# Altium schematic sheet CPU.SchDoc
size A3
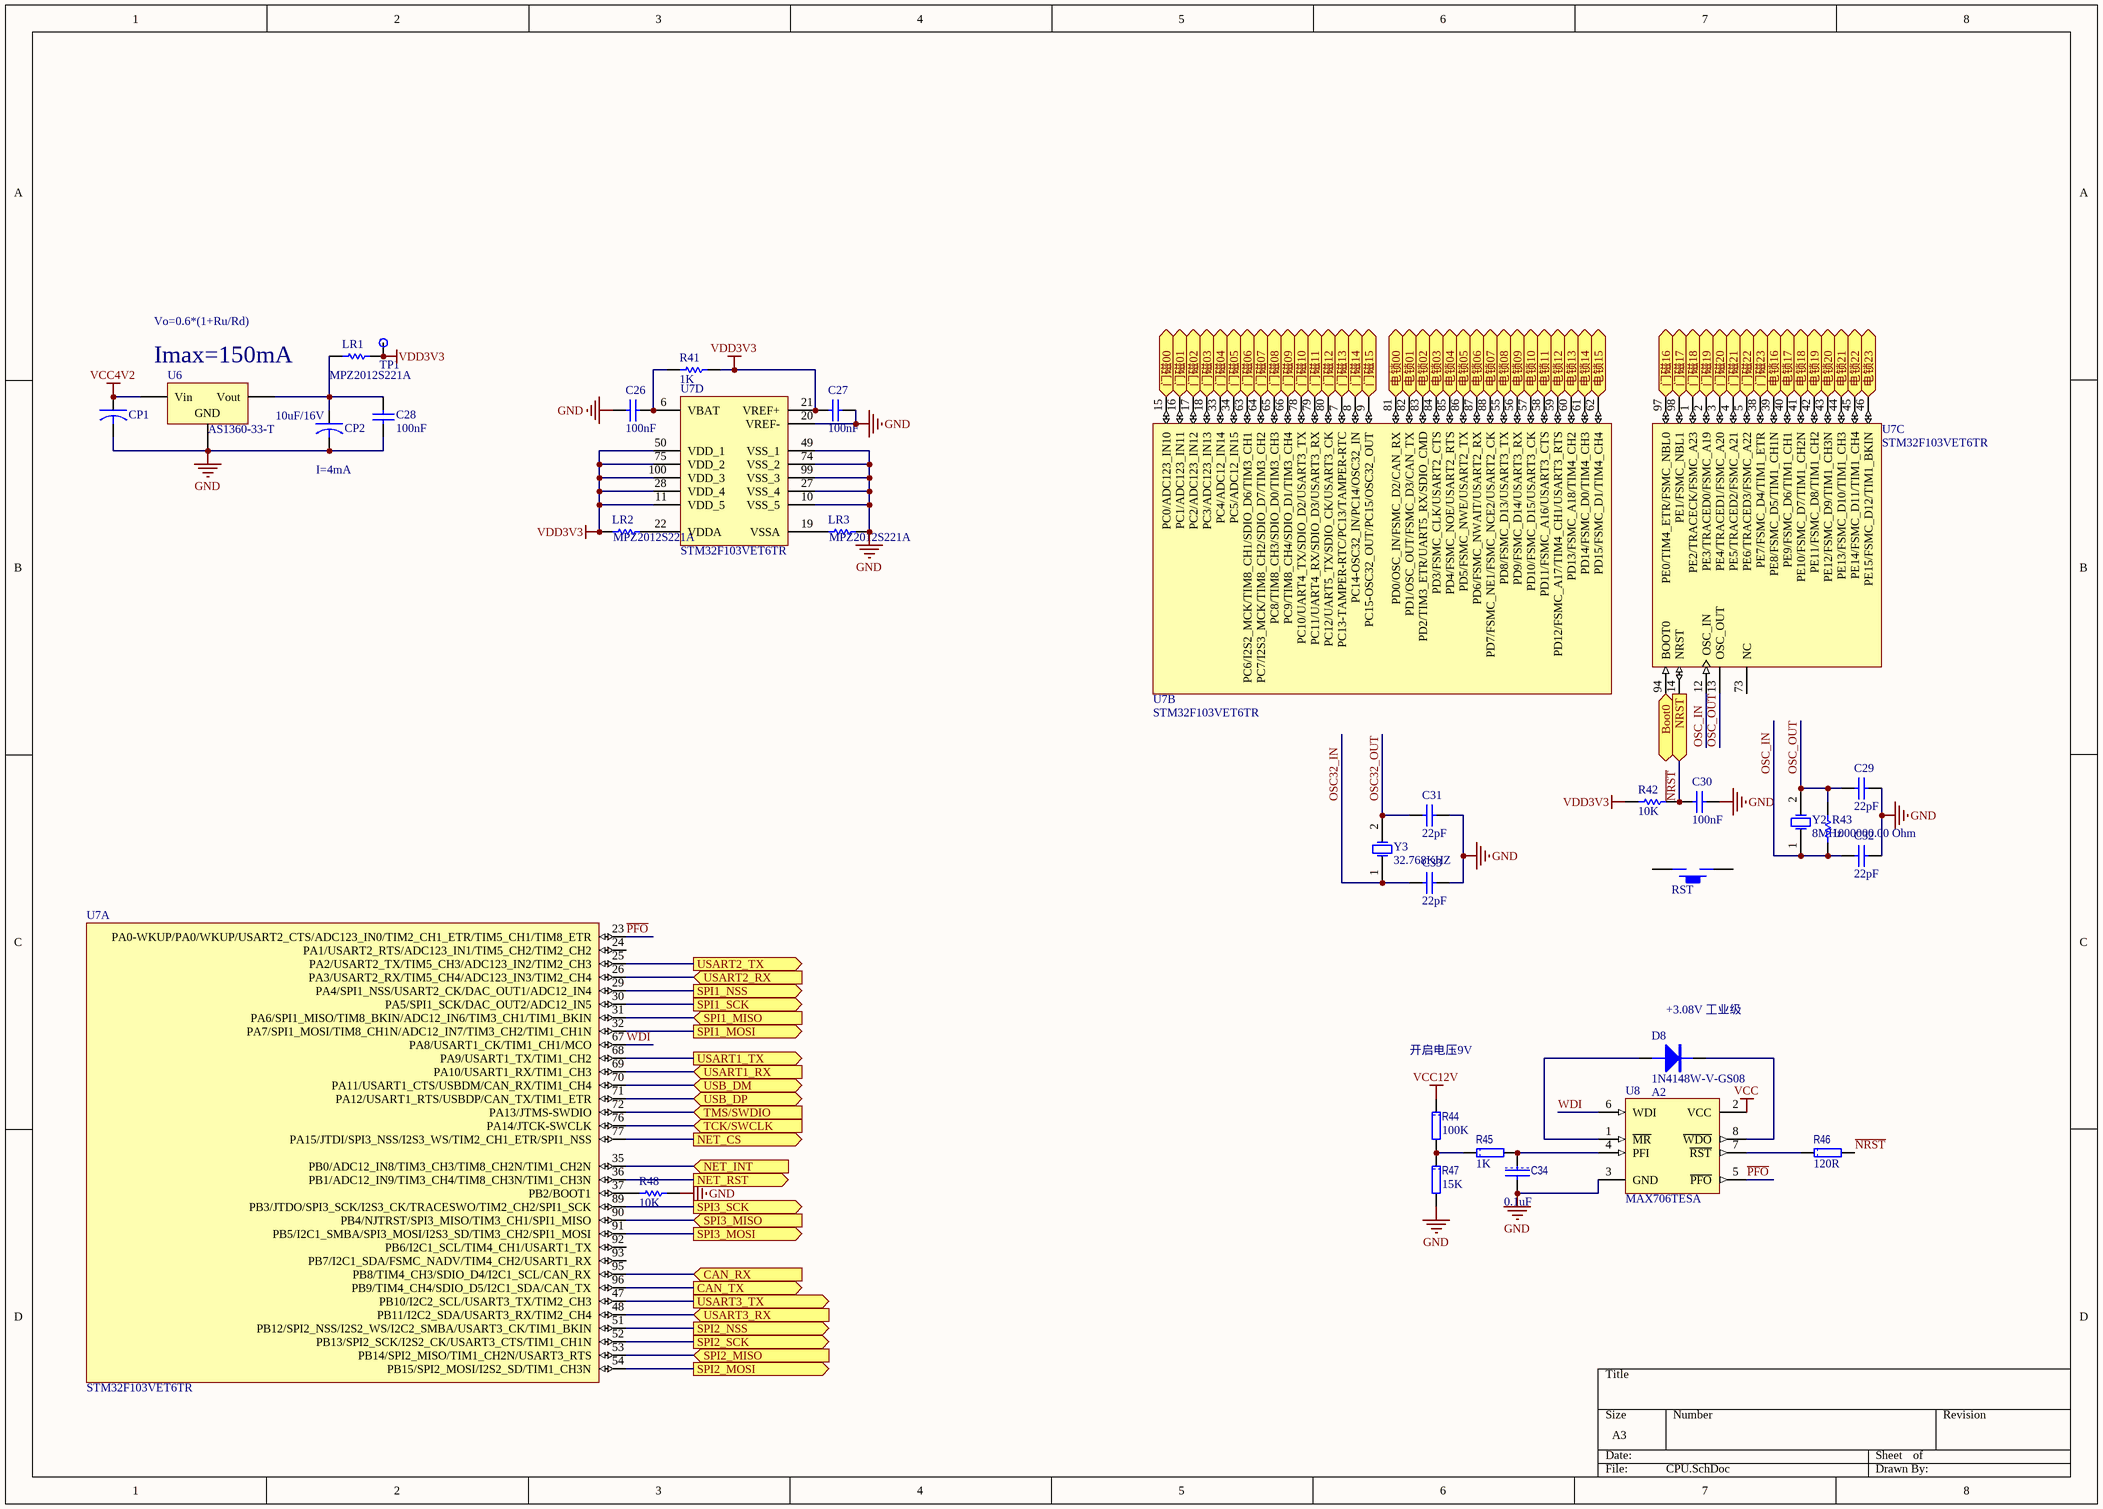
[diagram p0: CPU.SchDoc]

## Parts
C26  value 100nF  [CAPC0805(2012)100_L]  (hidden comment: CAP 100nF 50V 0805(2012))
C27  value 100nF  [CAPC0805(2012)100_L]  (hidden comment: CAP 100nF 50V 0805(2012))
C28  value 100nF  [CAPC0805(2012)100_L]  (hidden comment: CAP 100nF 50V 0805(2012))
C29  value 22pF  [CAPC0805(2012)75_M]  (hidden comment: CAP 22pF 50V 0805(2012))
C30  value 100nF  [CAPC0805(2012)145_N]  (hidden comment: CAP 100nF 50V 0805(2012))
C31  value 22pF  [CAPC0805(2012)75_M]  (hidden comment: CAP 22pF 50V 0805(2012))
C32  value 22pF  [CAPC0805(2012)75_M]  (hidden comment: CAP 22pF 50V 0805(2012))
C33  value 22pF  [CAPC0805(2012)75_M]  (hidden comment: CAP 22pF 50V 0805(2012))
C34  value 0.1uF  [1608[0603]C]  (hidden comment: C1608X7R1H104K)
CP1  TAJA106K016RNJ  [3216[1206]CB]  (value not drawn)
CP2  value 10uF/16V  [3216[1206]CB]  (hidden comment: TAJA106K016RNJ)
D8  1N4148W-V-GS08  value A2  [SOD123]
LR1  MPZ2012S221A  [2012[0805]]
LR2  MPZ2012S221A  [2012[0805]]
LR3  MPZ2012S221A  [2012[0805]]
R41  value 1K  [RESC0805(2012)_M]  (hidden comment: 1K 1% 0805(2012))
R42  value 10K  [RESC0805(2012)_M]  (hidden comment: 10K 1% 0805(2012))
R43  value 1000000.00 Ohm  [RESC0805(2012)_N]  (hidden comment: 1M 1% 0805(2012))
R44  value 100K  [1608[0603]R]  (hidden comment: CRCW0603100KFKEA)
R45  value 1K  [1608[0603]R]  (hidden comment: CRCW06031K00FKEA)
R46  value 120R  [1608[0603]R]  (hidden comment: CRCW0603120RFKEA)
R47  value 15K  [1608[0603]R]  (hidden comment: CRCW060315K0FKEA)
R48  value 10K  [RESC0805(2012)_M]  (hidden comment: 10K 1% 0805(2012))
RST  KEY_M  [KEY_M]  (value not drawn)
TP1  TP  [TP]  (value not drawn)
U6  AS1360-33-T  [SOT23_N]
U7  STM32F103VET6TR  [STM-LQFP100_M]  (parts A,B,C,D of 4)
U8  MAX706TESA  [NSO8_N]
Y2  8MHz  [XTAL_US]
Y3  32.768KHZ  [XTAL32_1]

## Ports
Boot0 (in), CAN_RX (in), CAN_TX (out), NET_CS (out), NET_INT (in), NET_RST (out), NRST (in), SPI1_MISO (in), SPI1_MOSI (out), SPI1_NSS (out), SPI1_SCK (out), SPI2_MISO (in), SPI2_MOSI (out), SPI2_NSS (out), SPI2_SCK (out), SPI3_MISO (in), SPI3_MOSI (out), SPI3_SCK (out), TCK/SWCLK (in), TMS/SWDIO (in), USART1_RX (in), USART1_TX (out), USART2_RX (in), USART2_TX (out), USART3_RX (in), USART3_TX (out), USB_DM (bidir), USB_DP (bidir), 电锁00 (out), 电锁01 (out), 电锁02 (out), 电锁03 (out), 电锁04 (out), 电锁05 (out), 电锁06 (out), 电锁07 (out), 电锁08 (out), 电锁09 (out), 电锁10 (out), 电锁11 (out), 电锁12 (out), 电锁13 (out), 电锁14 (out), 电锁15 (out), 电锁16 (out), 电锁17 (out), 电锁18 (out), 电锁19 (out), 电锁20 (out), 电锁21 (out), 电锁22 (out), 电锁23 (out), 门磁00 (in), 门磁01 (in), 门磁02 (in), 门磁03 (in), 门磁04 (in), 门磁05 (in), 门磁06 (in), 门磁07 (in), 门磁08 (in), 门磁09 (in), 门磁10 (in), 门磁11 (in), 门磁12 (in), 门磁13 (in), 门磁14 (in), 门磁15 (in), 门磁16 (in), 门磁17 (in), 门磁18 (in), 门磁19 (in), 门磁20 (in), 门磁21 (in), 门磁22 (in), 门磁23 (in)

## Nets
GND: C26.2 C27.2 C28.1 C29.1 C30.1 C31.1 C32.1 C33.1 C34.2 CP1.2 CP2.2 LR3.2 R47.2 R48.1 U6.1(GND) U7.10(VSS_5) U7.20(VREF-) U7.27(VSS_4) U7.49(VSS_1) U7.74(VSS_2) U7.99(VSS_3) U8.3(GND)
VCC: U8.2(VCC)
VCC4V2: CP1.1 U6.3(Vin)
VCC12V: R44.1
VDD3V3: C27.1 LR1.1 LR2.1 R41.1 R42.2 TP1.1(TestPoint) U7.11(VDD_5) U7.21(VREF+) U7.28(VDD_4) U7.50(VDD_1) U7.75(VDD_2) U7.100(VDD_3)
Boot0: U7.94(BOOT0) ; port Boot0
CAN_RX: U7.95(PB8/TIM4_CH3/SDIO_D4/I2C1_SCL/CAN_RX) ; port CAN_RX
CAN_TX: U7.96(PB9/TIM4_CH4/SDIO_D5/I2C1_SDA/CAN_TX) ; port CAN_TX
~{NRST}: C30.2 R42.1 R46.2 U7.14(NRST) ; port NRST
NET_CS: U7.77(PA15/JTDI/SPI3_NSS/I2S3_WS/TIM2_CH1_ETR/SPI1_NSS) ; port NET_CS
NET_INT: U7.35(PB0/ADC12_IN8/TIM3_CH3/TIM8_CH2N/TIM1_CH2N) ; port NET_INT
NET_RST: U7.36(PB1/ADC12_IN9/TIM3_CH4/TIM8_CH3N/TIM1_CH3N) ; port NET_RST
OSC32_IN: C33.2 Y3.1(OSC1)
OSC32_OUT: C31.2 Y3.2(OSC2)
OSC_IN: C32.2 R43.1 U7.12(OSC_IN) Y2.1(OSC1)
OSC_OUT: C29.2 R43.2 U7.13(OSC_OUT) Y2.2(OSC2)
~{PFO}: U7.23(PA0-WKUP/PA0/WKUP/USART2_CTS/ADC123_IN0/TIM2_CH1_ETR/TIM5_CH1/TIM8_ETR) U8.5(~{PFO})
SPI1_MISO: U7.31(PA6/SPI1_MISO/TIM8_BKIN/ADC12_IN6/TIM3_CH1/TIM1_BKIN) ; port SPI1_MISO
SPI1_MOSI: U7.32(PA7/SPI1_MOSI/TIM8_CH1N/ADC12_IN7/TIM3_CH2/TIM1_CH1N) ; port SPI1_MOSI
SPI1_NSS: U7.29(PA4/SPI1_NSS/USART2_CK/DAC_OUT1/ADC12_IN4) ; port SPI1_NSS
SPI1_SCK: U7.30(PA5/SPI1_SCK/DAC_OUT2/ADC12_IN5) ; port SPI1_SCK
SPI2_MISO: U7.53(PB14/SPI2_MISO/TIM1_CH2N/USART3_RTS) ; port SPI2_MISO
SPI2_MOSI: U7.54(PB15/SPI2_MOSI/I2S2_SD/TIM1_CH3N) ; port SPI2_MOSI
SPI2_NSS: U7.51(PB12/SPI2_NSS/I2S2_WS/I2C2_SMBA/USART3_CK/TIM1_BKIN) ; port SPI2_NSS
SPI2_SCK: U7.52(PB13/SPI2_SCK/I2S2_CK/USART3_CTS/TIM1_CH1N) ; port SPI2_SCK
SPI3_MISO: U7.90(PB4/NJTRST/SPI3_MISO/TIM3_CH1/SPI1_MISO) ; port SPI3_MISO
SPI3_MOSI: U7.91(PB5/I2C1_SMBA/SPI3_MOSI/I2S3_SD/TIM3_CH2/SPI1_MOSI) ; port SPI3_MOSI
SPI3_SCK: U7.89(PB3/JTDO/SPI3_SCK/I2S3_CK/TRACESWO/TIM2_CH2/SPI1_SCK) ; port SPI3_SCK
TCK/SWCLK: U7.76(PA14/JTCK-SWCLK) ; port TCK/SWCLK
TMS/SWDIO: U7.72(PA13/JTMS-SWDIO) ; port TMS/SWDIO
USART1_RX: U7.69(PA10/USART1_RX/TIM1_CH3) ; port USART1_RX
USART1_TX: U7.68(PA9/USART1_TX/TIM1_CH2) ; port USART1_TX
USART2_RX: U7.26(PA3/USART2_RX/TIM5_CH4/ADC123_IN3/TIM2_CH4) ; port USART2_RX
USART2_TX: U7.25(PA2/USART2_TX/TIM5_CH3/ADC123_IN2/TIM2_CH3) ; port USART2_TX
USART3_RX: U7.48(PB11/I2C2_SDA/USART3_RX/TIM2_CH4) ; port USART3_RX
USART3_TX: U7.47(PB10/I2C2_SCL/USART3_TX/TIM2_CH3) ; port USART3_TX
USB_DM: U7.70(PA11/USART1_CTS/USBDM/CAN_RX/TIM1_CH4) ; port USB_DM
USB_DP: U7.71(PA12/USART1_RTS/USBDP/CAN_TX/TIM1_ETR) ; port USB_DP
WDI: U7.67(PA8/USART1_CK/TIM1_CH1/MCO) U8.6(WDI)
电锁00: U7.81(PD0/OSC_IN/FSMC_D2/CAN_RX) ; port 电锁00
电锁01: U7.82(PD1/OSC_OUT/FSMC_D3/CAN_TX) ; port 电锁01
电锁02: U7.83(PD2/TIM3_ETR/UART5_RX/SDIO_CMD) ; port 电锁02
电锁03: U7.84(PD3/FSMC_CLK/USART2_CTS) ; port 电锁03
电锁04: U7.85(PD4/FSMC_NOE/USART2_RTS) ; port 电锁04
电锁05: U7.86(PD5/FSMC_NWE/USART2_TX) ; port 电锁05
电锁06: U7.87(PD6/FSMC_NWAIT/USART2_RX) ; port 电锁06
电锁07: U7.88(PD7/FSMC_NE1/FSMC_NCE2/USART2_CK) ; port 电锁07
电锁08: U7.55(PD8/FSMC_D13/USART3_TX) ; port 电锁08
电锁09: U7.56(PD9/FSMC_D14/USART3_RX) ; port 电锁09
电锁10: U7.57(PD10/FSMC_D15/USART3_CK) ; port 电锁10
电锁11: U7.58(PD11/FSMC_A16/USART3_CTS) ; port 电锁11
电锁12: U7.59(PD12/FSMC_A17/TIM4_CH1/USART3_RTS) ; port 电锁12
电锁13: U7.60(PD13/FSMC_A18/TIM4_CH2) ; port 电锁13
电锁14: U7.61(PD14/FSMC_D0/TIM4_CH3) ; port 电锁14
电锁15: U7.62(PD15/FSMC_D1/TIM4_CH4) ; port 电锁15
电锁16: U7.39(PE8/FSMC_D5/TIM1_CH1N) ; port 电锁16
电锁17: U7.40(PE9/FSMC_D6/TIM1_CH1) ; port 电锁17
电锁18: U7.41(PE10/FSMC_D7/TIM1_CH2N) ; port 电锁18
电锁19: U7.42(PE11/FSMC_D8/TIM1_CH2) ; port 电锁19
电锁20: U7.43(PE12/FSMC_D9/TIM1_CH3N) ; port 电锁20
电锁21: U7.44(PE13/FSMC_D10/TIM1_CH3) ; port 电锁21
电锁22: U7.45(PE14/FSMC_D11/TIM1_CH4) ; port 电锁22
电锁23: U7.46(PE15/FSMC_D12/TIM1_BKIN) ; port 电锁23
门磁00: U7.15(PC0/ADC123_IN10) ; port 门磁00
门磁01: U7.16(PC1/ADC123_IN11) ; port 门磁01
门磁02: U7.17(PC2/ADC123_IN12) ; port 门磁02
门磁03: U7.18(PC3/ADC123_IN13) ; port 门磁03
门磁04: U7.33(PC4/ADC12_IN14) ; port 门磁04
门磁05: U7.34(PC5/ADC12_IN15) ; port 门磁05
门磁06: U7.63(PC6/I2S2_MCK/TIM8_CH1/SDIO_D6/TIM3_CH1) ; port 门磁06
门磁07: U7.64(PC7/I2S3_MCK/TIM8_CH2/SDIO_D7/TIM3_CH2) ; port 门磁07
门磁08: U7.65(PC8/TIM8_CH3/SDIO_D0/TIM3_CH3) ; port 门磁08
门磁09: U7.66(PC9/TIM8_CH4/SDIO_D1/TIM3_CH4) ; port 门磁09
门磁10: U7.78(PC10/UART4_TX/SDIO_D2/USART3_TX) ; port 门磁10
门磁11: U7.79(PC11/UART4_RX/SDIO_D3/USART3_RX) ; port 门磁11
门磁12: U7.80(PC12/UART5_TX/SDIO_CK/USART3_CK) ; port 门磁12
门磁13: U7.7(PC13-TAMPER-RTC/PC13/TAMPER-RTC) ; port 门磁13
门磁14: U7.8(PC14-OSC32_IN/PC14/OSC32_IN) ; port 门磁14
门磁15: U7.9(PC15-OSC32_OUT/PC15/OSC32_OUT) ; port 门磁15
门磁16: U7.97(PE0/TIM4_ETR/FSMC_NBL0) ; port 门磁16
门磁17: U7.98(PE1/FSMC_NBL1) ; port 门磁17
门磁18: U7.1(PE2/TRACECK/FSMC_A23) ; port 门磁18
门磁19: U7.2(PE3/TRACED0/FSMC_A19) ; port 门磁19
门磁20: U7.3(PE4/TRACED1/FSMC_A20) ; port 门磁20
门磁21: U7.4(PE5/TRACED2/FSMC_A21) ; port 门磁21
门磁22: U7.5(PE6/TRACED3/FSMC_A22) ; port 门磁22
门磁23: U7.38(PE7/FSMC_D4/TIM1_ETR) ; port 门磁23
NetC26_1: C26.1 R41.2 U7.6(VBAT)
NetC28_2: C28.2 CP2.1 LR1.2 U6.2(Vout)
NetC34_1: C34.1 R45.2 U8.4(PFI)
NetD8_1: D8.1(A) U8.1(~{MR})
NetD8_2: D8.2(K) U8.8(~{WDO})
NetLR2_2: LR2.2 U7.22(VDDA)
NetLR3_1: LR3.1 U7.19(VSSA)
NetR44_2: R44.2 R45.1 R47.1
NetR46_1: R46.1 U8.7(~{RST})
NetR48_2: R48.2 U7.37(PB2/BOOT1)

Not connected (* = marked no-connect by the designer): RST 1 2; U7 24(PA1/USART2_RTS/ADC123_IN1/TIM5_CH2/TIM2_CH2) 73(NC) 92(PB6/I2C1_SCL/TIM4_CH1/USART1_TX) 93(PB7/I2C1_SDA/FSMC_NADV/TIM4_CH2/USART1_RX)

## Notes on the sheet
- (near U6) Imax=150mA
- Vo=0.6*(1+Ru/Rd)
- (near CP2) I=4mA
- 开启电压9V
- (near D8) +3.08V 工业级

## Library data of the parts
C26-C28 = CMP-1036-04418-1: CAP 100nF 50V ±5% 0805 (2012 Metric) Thickness 1mm SMD; Case-EIA: 0805; Case-Metric: 2012; Tolerance: ±5%; Max Thickness: 1 mm; Technology: SMT; Rated Voltage: 50 V
C29 C31-C33 = CMP-1036-01234-1: CAP 22pF 50V ±1% 0805 (2012 Metric) Thickness 0.75mm SMD; Case-EIA: 0805; Case-Metric: 2012; Rated Voltage: 50 V; Tolerance: ±1%; Technology: SMT; Max Thickness: 0.75 mm
C30 = CMP-1036-04417-1: CAP 100nF 50V ±5% 0805 (2012 Metric) Thickness 1.45mm SMD; Case-Metric: 2012; Case-EIA: 0805; Max Thickness: 1.45 mm; Tolerance: ±5%; Rated Voltage: 50 V; Technology: SMT
C34 = CAP: 多层陶瓷电容器MLCC - SMD/SMT 0603 0.1uF 50volts X7R 10%; Manufacturer: TDK; 产品: General Type MLCCs; 产品种类: Low & Medium Capacitance SMD Ceramic Chip Capacitors; 外壳代码 - in: 0603; 外壳代码 - mm: 1608; 封装 / 箱体: 0603 (1608 metric); 封装: Reel; 尺寸: 0.8 mm W x 1.6 mm L x 0.8 mm H; 工作温度范围: - 55 C to + 125 C; 标准包装数量: 4000; 电压额定值: 50 V; 电容-nF: 100 nF; 电容-pF: 100000 pF; 系列: C; Category: 多层陶瓷电容器MLCC - SMD/SMT; ComponentLink1Description: http://www.tdk.com/pdf/general_B11.pdf; ComponentLink1URL: http://www.tdk.com/pdf/general_B11.pdf; Description 1: 多层陶瓷电容器MLCC - SMD/SMT 0603 0.1uF 50volts X7R 10%; Manufacturer Part Number: C1608X7R1H104K; Minimum Order Quantity: 1; Pricing 1: 1=0.160, 50=0.070, 100=0.036, 500=0.019, 1000=0.013, 4000=0.010, 8000=0.009, 12000=0.008, 20000=0.007 (USD); Reeling: True; RoHS - 贸泽: Y; RoHS: RoHS Compliant; Stock 1: 224604; Supplier 1: Mouser; Supplier Part Number 1: 810-C1608X7R1H104K; 制造商: TDK; 容差: 10 %; 温度系数/代码: X7R; 电容: 0.1 uF; 端接类型: SMD/SMT
CP1 CP2 = CAPACITOR: 钽质电容器-固体SMD 16volts 10uF 10%; Manufacturer: AVX; ESR: 3 Ohms; 产品: Tantalum Solid Standard Grade - Other Various; 产品种类: SMD Tantalum Capacitors; 制造商库存号: A Case; 外壳代码 - in: 1206; 外壳代码 - mm: 3216; 封装 / 箱体: 1206 (3216 metric); 封装: Reel; 尺寸: 1.6 mm W x 3.2 mm L; 工作温度范围: - 55 C to + 125 C; 损耗因数 DF: 8; 标准包装数量: 2000; 漏泄电流: 1.6 uA; 电压额定值: 16 V; 端接类型: SMD/SMT; 系列: TAJ; 高度: 1.8 mm; Category: 钽质电容器-固体SMD; ComponentLink1Description: http://www.avx.com/docs/Catalogs/taj.pdf; ComponentLink1URL: http://www.avx.com/docs/Catalogs/taj.pdf; Description 1: 钽质电容器-固体SMD 16volts 10uF 10%; Manufacturer Part Number: TAJA106K016RNJ; Minimum Order Quantity: 1; Pricing 1: 1=0.600, 100=0.280, 200=0.250, 500=0.221, 1000=0.200, 2000=0.140, 5000=0.131, 10000=0.124, 25000=0.103 (USD); Reeling: True; RoHS - 贸泽: Y; RoHS: RoHS Compliant; Stock 1: 20335; Supplier 1: Mouser; Supplier Part Number 1: 581-TAJA106K016R; 制造商: AVX; 容差: 10 %; 电容: 10 uF
D8 = 1N4148W: 二极管 - 通用，功率，开关 100V Io/150mA; Manufacturer: Vishay Semiconductors; 配置: Single; 工作温度范围: - 65 C to + 150 C; 封装 / 箱体: SOD-123; 封装: Reel; 产品: Switching Diodes; 正向连续电流: 0.15 A; 最大浪涌电流: 0.5 A; 安装风格: SMD/SMT; 恢复时间: 4 ns; 正向电压下降: 1.2 V; 制造商: Vishay; 最大二极管电容: 4 pF; 最大工作温度: + 150 C; 最大功率耗散: 350 mW; 最大反向漏泄电流: 5 uA; 最小工作温度: - 65 C; 标准包装数量: 15000; Supplier 1: Mouser; Supplier Part Number 1: 625-1N4148W-V; Manufacturer Part Number: 1N4148W-V-GS08; RoHS: RoHS Compliant; Category: 二极管 - 通用，功率，开关; Stock 1: 404148; Pricing 1: 1=0.090, 10=0.083, 50=0.072, 100=0.068, 500=0.032, 1000=0.026, 3000=0.021, 9000=0.016, 10000=0.016, 18000=0.014 (USD); 峰值反向电压: 100 V; 产品种类: Switching Diodes; RoHS - 贸泽: Y; Minimum Order Quantity: 1; Reeling: True; ComponentLink1URL: http://www.mouser.com/ds/2/427/1n4148w--240387.pdf; ComponentLink1Description: http://www.mouser.com/ds/2/427/1n4148w--240387.pdf; Description 1: 二极管 - 通用，功率，开关 100V Io/150mA
LR1-LR3 = Res Semi: 电磁干扰滤波珠子、扼流圈和阵列 Ferrite Chip Beads; Manufacturer: TDK; 阻抗: 220 Ohms; 最大直流电流: 3 A; 最大直流电阻: 0.04 Ohms; 工作温度范围: - 55 C to + 125 C; 封装 / 箱体: 2012; 封装: Reel; 端接类型: SMD/SMT; 容差: 25 %; 产品种类: Ferrite Beads; 标准包装数量: 4000; Supplier 1: Mouser; Supplier Part Number 1: 810-MPZ2012S221A; Manufacturer Part Number: MPZ2012S221A; RoHS: RoHS Compliant; Description 1: 电磁干扰滤波珠子、扼流圈和阵列 Ferrite Chip Beads; Category: 电磁干扰滤波珠子、扼流圈和阵列; Stock 1: 26540; Pricing 1: 1=0.070, 50=0.060, 100=0.053, 500=0.040, 1000=0.035, 4000=0.031, 8000=0.029, 12000=0.025 (USD); 制造商: TDK; RoHS - 贸泽: Y; Minimum Order Quantity: 1; Reeling: True; ComponentLink1URL: http://www.mouser.com/ds/2/400/e9413_mpz-24582.pdf; ComponentLink1Description: http://www.mouser.com/ds/2/400/e9413_mpz-24582.pdf
R41 = CMP-1013-00510-1: 1K 0.125W 1% 0805 (2012 Metric)  SMD; Case-Metric: 2012; Case-EIA: 0805; Tolerance: 1 %; Power: 0.125 W; Technology: SMT
R42 R48 = CMP-1013-00623-1: 10K 0.125W 1% 0805 (2012 Metric)  SMD; Case-Metric: 2012; Case-EIA: 0805; Tolerance: 1 %; Power: 0.125 W; Technology: SMT
R43 = CMP-1013-00849-1: 1M 0.125W 1% 0805 (2012 Metric)  SMD; Case-Metric: 2012; Case-EIA: 0805; Technology: SMT; Power: 0.125 W; Tolerance: 1 %
R44 = RES: 厚膜电阻器 - SMD 1/10watt 100Kohms 1%; Manufacturer: Vishay / Dale; 尺寸: 0.85 mm W x 1.55 mm L x 0.45 mm H; 工作温度范围: - 55 C to + 155 C; 封装 / 箱体: 0603 (1608 metric); 封装: Reel; 功率额定值: 100 mW; 产品: Thick Film Resistors SMD; 系列: CRCW; 温度系数: 100 PPM / K; 端接类型: SMD/SMT; 电压额定值: 75 V; 制造商: Vishay; 产品种类: 0603 Thick Film Chip Resistors; 标准包装数量: 5000; 外壳代码 - in: 0603; 外壳代码 - mm: 1608; Supplier 1: Mouser; Supplier Part Number 1: 71-CRCW0603-100K-E3; Manufacturer Part Number: CRCW0603100KFKEA; RoHS: RoHS Compliant By Exemption; Category: 厚膜电阻器 - SMD; Stock 1: 175756; Pricing 1: 1=0.080, 10=0.013, 100=0.010, 1000=0.008, 5000=0.005, 25000=0.004, 50000=0.003 (USD); 电阻: 100 kOhms; 容差: 1 %; RoHS - 贸泽: E; Minimum Order Quantity: 1; Reeling: True; ComponentLink1URL: http://www.mouser.com/ds/2/427/dcrcwe3-109170.pdf; ComponentLink1Description: http://www.mouser.com/ds/2/427/dcrcwe3-109170.pdf; Description 1: 厚膜电阻器 - SMD 1/10watt 100Kohms 1%
R45 = RES: 厚膜电阻器 - SMD 1/10watt 1.0Kohms 1%; Manufacturer: Vishay / Dale; 尺寸: 0.85 mm W x 1.55 mm L x 0.45 mm H; 工作温度范围: - 55 C to + 155 C; 封装 / 箱体: 0603 (1608 metric); 封装: Reel; 功率额定值: 100 mW; 产品: Thick Film Resistors SMD; 电阻: 1 kOhms; 系列: CRCW; 温度系数: 100 PPM / K; 端接类型: SMD/SMT; 电压额定值: 75 V; 制造商: Vishay; 产品种类: 0603 Thick Film Chip Resistors; 标准包装数量: 5000; 外壳代码 - in: 0603; 外壳代码 - mm: 1608; Supplier 1: Mouser; Supplier Part Number 1: 71-CRCW0603-1.0K-E3; Manufacturer Part Number: CRCW06031K00FKEA; RoHS: RoHS Compliant By Exemption; Category: 厚膜电阻器 - SMD; Stock 1: 276938; Pricing 1: 1=0.080, 10=0.013, 100=0.010, 1000=0.008, 5000=0.005, 25000=0.004, 50000=0.003 (USD); 容差: 1 %; RoHS - 贸泽: E; Minimum Order Quantity: 1; Reeling: True; ComponentLink1URL: http://www.mouser.com/ds/2/427/dcrcwe3-109170.pdf; ComponentLink1Description: http://www.mouser.com/ds/2/427/dcrcwe3-109170.pdf; Description 1: 厚膜电阻器 - SMD 1/10watt 1.0Kohms 1%
R46 = RES: 厚膜电阻器 - SMD 1/10watt 120ohms 1%; Manufacturer: Vishay / Dale; 尺寸: 0.85 mm W x 1.55 mm L x 0.45 mm H; 工作温度范围: - 55 C to + 155 C; 封装 / 箱体: 0603 (1608 metric); 封装: Reel; 功率额定值: 100 mW; 产品: Thick Film Resistors SMD; 系列: CRCW; 温度系数: 100 PPM / K; 端接类型: SMD/SMT; 电压额定值: 75 V; 外壳代码 - in: 0603; 外壳代码 - mm: 1608; 制造商: Vishay; 产品种类: 0603 Thick Film Chip Resistors; 标准包装数量: 5000; Supplier 1: Mouser; Supplier Part Number 1: 71-CRCW0603-120-E3; Manufacturer Part Number: CRCW0603120RFKEA; RoHS: RoHS Compliant By Exemption; Category: 厚膜电阻器 - SMD; Stock 1: 11148; Pricing 1: 1=0.080, 10=0.013, 100=0.010, 1000=0.008, 5000=0.005, 25000=0.004, 50000=0.003 (USD); 电阻: 120 Ohms; 容差: 1 %; RoHS - 贸泽: E; Minimum Order Quantity: 1; Reeling: True; ComponentLink1URL: http://www.mouser.com/ds/2/427/dcrcwe3-109170.pdf; ComponentLink1Description: http://www.mouser.com/ds/2/427/dcrcwe3-109170.pdf; Description 1: 厚膜电阻器 - SMD 1/10watt 120ohms 1%
R47 = RES: 厚膜电阻器 - SMD 1/10watt 15Kohms 1%
TP1 = Test Point
U6 = Volt Reg: LDO Voltage Controllers; Manufacturer: ams; Input Voltage MAX: 20 V; Output Current: 150 mA; Output Voltage: 3.3 V; Product Status: New at Mouser; Supplier 1: Mouser; Supplier Part Number 1: 985-AS1360-33-T; Manufacturer Part Number: AS1360-33-T; RoHS: RoHS Compliant; Category: LDO Voltage Controllers; Stock 1: 4086; Pricing 1: 1=1.82, 10=1.46, 100=1.12, 500=0.991, 1000=0.783, 2500=0.730, 5000=0.695, 10000=0.680 (AUD); Package / Case: SOT-23-3; Packaging: Reel; Mounting Style: SMD/SMT; Maximum Operating Temperature: + 85 C; Minimum Operating Temperature: - 40 C; RoHS - Mouser: Y; Minimum Order Quantity: 1; Reeling: True; ComponentLink1URL: http://ams.com/eng/content/download/1325/7334/424; ComponentLink1Description: http://ams.com/eng/content/download/1325/7334/424
U7 = CMP-0237-00166-2: ARM Cortex-M3 32-bit MCU, 512 KB Flash, 64 KB Internal RAM, 80 I/Os, 100-pin LQFP, -40 to 85 degC, Tape and Reel; D/A Converter: 2x12-bit (2 Channel); I/Os (High Current): 80; Supply Voltage(Vcc) min (V): 2; Operating Frequency(F) (Processor speed) (MHz): 72; A/D Converter: 3x12-bit (16 Channel); FLASH Size (Prog) (kB): 512; Internal RAM Size (kB): 64; Mounting Technology: Surface Mount; ComponentLink2URL: http://www.st.com/st-web-ui/static/active/en/resource/technical/document/datasheet/CD00191185.pdf; ComponentLink1Description: Manufacturer URL; PackageReference: LQFP100; ComponentLink2Description: Datasheet; PackageVersion: Rev. 1, 06/2013; Core: ARM Cortex-M3; ComponentLink3URL: http://www.st.com/st-web-ui/static/active/en/resource/technical/document/data_brief/DM00071938.pdf; ComponentLink3Description: Package Specification; DatasheetVersion: Rev. 8; PartNumber: STM32F103VET6TR; Packing: Tape and Reel; ComponentLink1URL: http://www.st.com/web/en/home.html; PackageDescription: 100-Pin Low Profile Quad Flat Package, 14 x 14 mm Body, 0.5 mm Pitch
U8 = MAX706TESA: +3V Voltage Monitoring, Low-Cost, 礟 Supervisory Circuit; Published: 16-Jan-2001; LatestRevisionDate: 13-Apr-2006; LatestRevisionNote: IPC-7351 Footprint Added.; DatasheetVersion: Sep-1995; PackageReference: NSO8; Publisher: Altium Limited; PackageDescription: 8-Pin Small Outline Integrated Circuit 1.27 mm Pitch; Code_JEDEC: MS-012-AA; Code_IPC: SOIC127P600-8; ComponentLink1Description: Manufacturer Link; ComponentLink1URL: http://www.maxim-ic.com/; ComponentLink2Description: Datasheet; ComponentLink2URL: http://pdfserv.maxim-ic.com/en/ds/MAX706P-MAX708T.pdf
Y2 Y3 = XTAL: Crystal Oscillator; Published: 8-Jun-2000; LatestRevisionDate: 17-Jul-2002; LatestRevisionNote: Re-released for DXP Platform.; Publisher: Altium Limited